# EAGLE design v2_rev0 (EAGLE 5.11)
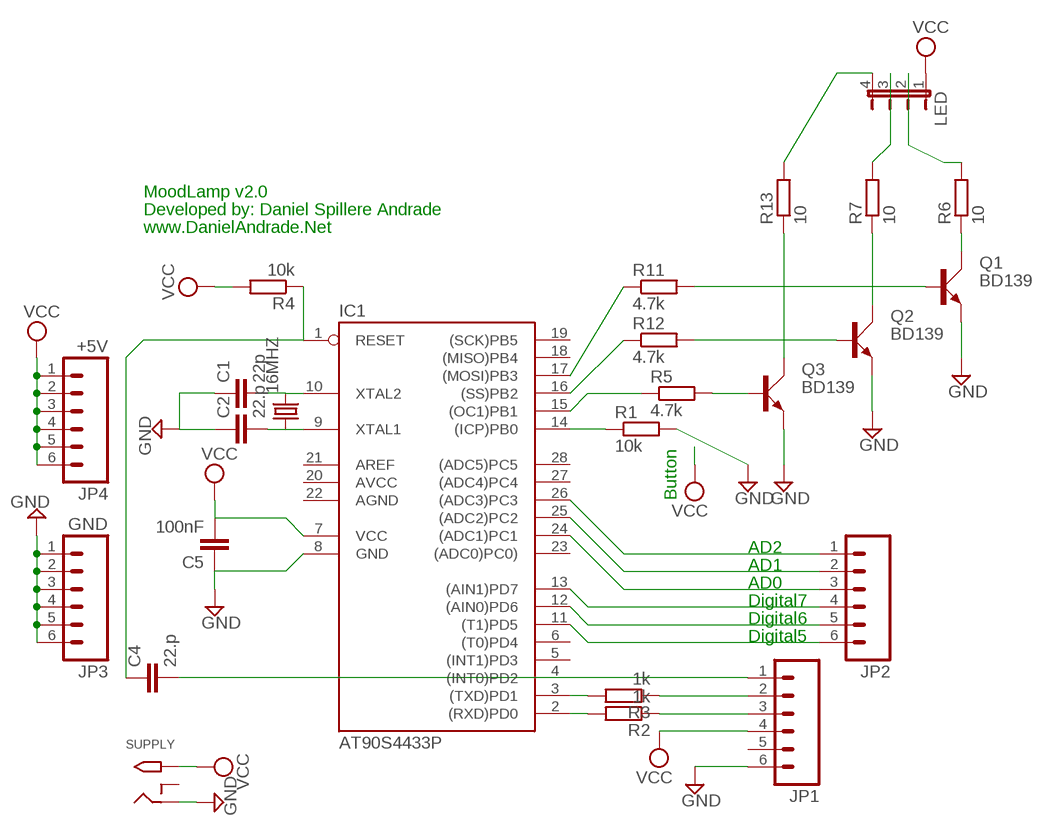
[diagram p0: schematic, sheet 1]

## Parts
16MHZ  CRYSTALHC49S  [HC49/S]
C1  22p  C5/2.5  [C5B2.5]
C2  22.p  C5/2.5  [C5B2.5]
C4  22.p  C5/2.5  [C5B2.5]
C5  100nF  C5/2.5  [C5B2.5]
IC1  AT90S4433P  [DIL28-3]
JP1  M06SIP  [1X06]
JP2  M06SIP  [1X06]
JP3  GND  M06SIP  [1X06]
JP4  +5V  M06SIP  [1X06]
LED  JP4E  [JP4]
Q1  BD139  [TO126AV]
Q2  BD139  [TO126AV]
Q3  BD139  [TO126AV]
R1  10k  R-EU_0309/V  [0309V]
R2  1k  R-EU_0207/10  [0207/10]
R3  1k  R-EU_0207/10  [0207/10]
R4  10k  R-EU_0207/10  [0207/10]
R5  4.7k  R-EU_0207/10  [0207/10]
R6  10  R-EU_0207/10  [0207/10]
R7  10  R-EU_0207/10  [0207/10]
R11  4.7k  R-EU_0207/10  [0207/10]
R12  4.7k  R-EU_0207/10  [0207/10]
R13  10  R-EU_0207/10  [0207/10]
SUPPLY  2.1MMJACKTHM  [PJ-102A]

## Nets
N$1: C4.1 IC1.1(RESET) R4.1
N$2: 16MHZ.2 C1.2 IC1.10(XTAL2)
N$3: 16MHZ.1 C2.2 IC1.9(XTAL1)
N$4: IC1.15((OC1)PB1) R5.1
N$5: IC1.16((SS)PB2) R12.1
N$6: IC1.17((MOSI)PB3) R11.1
N$7: Q3.B R5.2
N$8: Q2.B R12.2
N$9: Q1.B R11.2
N$10: Q2.C R7.1
N$11: Q3.C R13.1
N$12: Q1.C R6.1
N$14: IC1.2((RXD)PD0) R2.2
N$15: IC1.3((TXD)PD1) R3.2
N$16: JP1.3 R2.1
N$17: JP1.2 R3.1
N$18: C4.2 JP1.1
N$19: IC1.11((T1)PD5) JP2.6
N$20: IC1.12((AIN0)PD6) JP2.5
N$21: IC1.13((AIN1)PD7) JP2.4
N$22: IC1.24((ADC1)PC1) JP2.3
N$23: IC1.25((ADC2)PC2) JP2.2
N$24: IC1.26((ADC3)PC3) JP2.1
N$25: LED.2 R6.2
N$26: IC1.14((ICP)PB0) R1.1
N$29: C1.1 C2.1 C5.1 IC1.8(GND) JP1.6 JP3.1 JP3.2 JP3.3 JP3.4 JP3.5 JP3.6 Q1.E Q2.E Q3.E R1.2 SUPPLY.RING ; supply symbol labelled GND
N$30: LED.3 R7.2
N$31: LED.4 R13.2
VCC: C5.2 IC1.7(VCC) JP1.4 JP4.1 JP4.2 JP4.3 JP4.4 JP4.5 JP4.6 LED.1 R4.2 SUPPLY.TIP
Unconnected: IC1.4((INT0)PD2) IC1.5((INT1)PD3) IC1.6((T0)PD4) IC1.18((MISO)PB4) IC1.19((SCK)PB5) IC1.21(AREF) IC1.23((ADC0)PC0)) IC1.27((ADC4)PC4) IC1.28((ADC5)PC5) JP1.5 SUPPLY.RING_SW

## Notes on the sheet
- MoodLamp v2.0
- Developed by: Daniel Spillere Andrade
- www.DanielAndrade.Net
- Button
- AD2
- AD1
- AD0
- Digital7
- Digital6
- Digital5

## Power pins joined to a net without a drawn wire
AGND: IC1.22(AGND)
AVCC: IC1.20(AVCC)

## Library data of the parts
16MHZ = crystal:CRYSTAL: CRYSTAL; OC_FARNELL: 1667008; OC_NEWARK: unknown
C1 C2 C4 C5 = capacitor-wima:C: CAPACITOR naming: grid - package width
IC1 = atmel:AT90S4433: MICROCONTROLLER 4 Kbytes FLASH 128 bytes SRAM 256 bytes EEPROM UART 6-channel 10 bit ADC; OC_FARNELL: unknown; OC_NEWARK: unknown
JP1-JP4 = SparkFun:M06: Header 6 Standard 6-pin 0.1" header. Use with straight break away headers (SKU : PRT-00116), right angle break away headers (PRT-00553), swiss pins (PRT-00743), machine pins (PRT-00117), and female headers (PRT-00115). Molex polarized connector foot print use with SKU : PRT-08094 with associated crimp pins and housings. NOTES ON THE VARIANTS LOCK and LOCK_LONGPADS... This footprint was designed to help hold the alignment of a through-hole component (i.e. 6-pin header) while soldering it into place. You may notice that each hole has been shifted either up or down by 0.005 of an inch from it's more standard position (which is a perfectly straight line). This slight alteration caused the pins (the squares in the middle) to touch the edges of the holes. Because they are alternating, it causes a "brace" to hold the component in place. 0.005 has proven to be the perfect amount of "off-center" position when using our standard breakaway headers. Although looks a little odd when you look at the bare footprint, once you have a header in there, the alteration is very hard to notice. Also, if you push a header all the way into place, it is covered up entirely on the bottom side. This idea of altering the position of holes to aid alignment will be further integrated into the Sparkfun Library for other footprints. It can help hold any component with 3 or more connection pins.
LED = jumper:JP4E: JUMPER
Q1-Q3 = transistor-power:BD139: NPN TRANSISTOR
R1 = rcl:R-EU_: RESISTOR, European symbol
R2-R7 R11-R13 = resistor:R-EU_: RESISTOR, European symbol
SUPPLY = adafruit:2.1MMJACK: 2.1mm x 5.5mm THM DC jack with internal switch. Digikey part #PJ-102A, 4UCON part #05537 2.1mm x 5.5mm SMT DC jack with internal switch. Digikey part #PJ-002A-SMT, 4UCON part #03267 By microbuilder.eu & adafruit.com

## Board
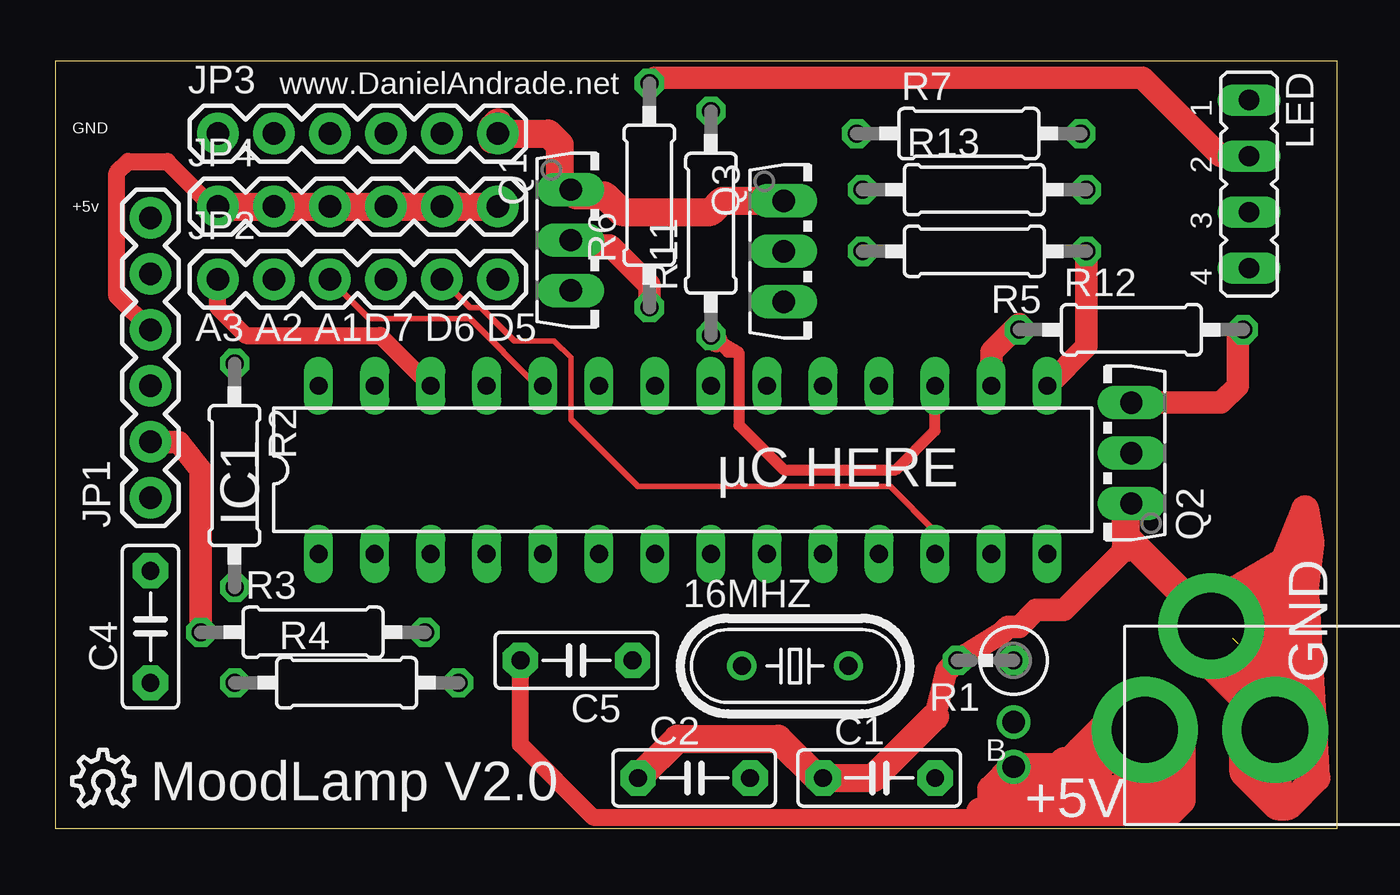
[diagram p1: board, top side]
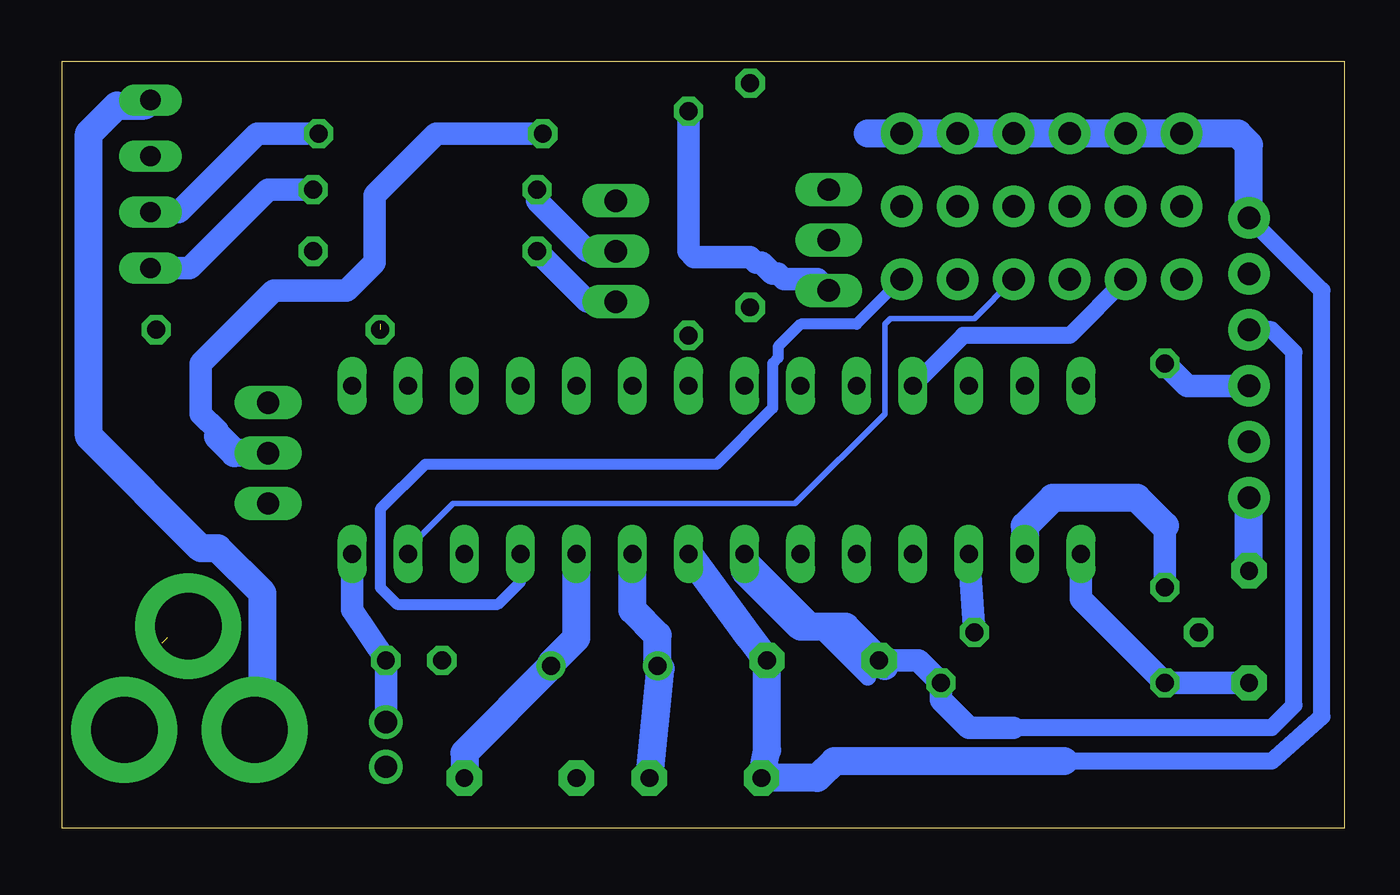
[diagram p2: board, bottom side, seen from below]

Size 58.09 x 34.79 mm. Coordinates in mm from the lower left corner, seen from the top.
Outline: 0,0 58.09,0 58.09,34.79 0,34.79 0,0
Copper layers (1*16): Top 0.035mm / dielectric 1.5mm / Bottom 0.035mm
Design rules "default": minimum track width 10mil, minimum drill 24mil, track to track 8mil, track to pad 8mil, pad to pad 8mil, via to via 8mil, smd to smd 8mil, copper to edge 40mil, drill to drill 8mil, minimum pad ring 10mil, minimum via ring 8mil, stop-mask expansion 4mil, vias tented up to drill 0mil, thermal gap 10mil

### Footprints (pad centres in the part's own frame; a part is rotated, then mirrored left to right if it is on the bottom)
HC49/S = drill 0.813 round: 1 -2.413,0; 2 2.413,0
C5B2.5 = drill 0.813 pad 1.6 octagon: 1 -2.54,0; 2 2.54,0
DIL28-3 = drill 0.813 long: 1 -16.51,-3.81; 2 -13.97,-3.81; 3 -11.43,-3.81; 4 -8.89,-3.81; 5 -6.35,-3.81; 6 -3.81,-3.81; 7 -1.27,-3.81; 8 1.27,-3.81; 9 3.81,-3.81; 10 6.35,-3.81; 11 8.89,-3.81; 12 11.43,-3.81; 13 13.97,-3.81; 14 16.51,-3.81; 15 16.51,3.81; 16 13.97,3.81; 17 11.43,3.81; 18 8.89,3.81; 19 6.35,3.81; 20 3.81,3.81; 21 1.27,3.81; 22 -1.27,3.81; 23 -3.81,3.81; 24 -6.35,3.81; 25 -8.89,3.81; 26 -11.43,3.81; 27 -13.97,3.81; 28 -16.51,3.81
1X06 = drill 1.016 pad 1.88 round: 1 0,0; 2 2.54,0; 3 5.08,0; 4 7.62,0; 5 10.16,0; 6 12.7,0
JP4 = drill 0.914 long: 1 -3.81,0; 2 -1.27,0; 3 1.27,0; 4 3.81,0
TO126AV = drill 1.016 long: B 2.286,-1.27; C 0,-1.27; E -2.286,-1.27
0309V = drill 0.813 octagon: 1 -1.27,0; 2 1.27,0
0207/10 = drill 0.813 octagon: 1 -5.08,0; 2 5.08,0
PJ-102A = drill 3 pad 4.8 round: RING 0.1,-3.39; RING_SW -4.6,-6.29; TIP 0.1,-9.29

### Placement (x,y rotation side)
16MHZ  33.53,7.37 0 top
C1  37.34,2.29 0 top
C2  28.96,2.29 0 top
C4  4.32,9.14 90 top
C5  23.62,7.62 180 top
IC1  28.45,16.26 0 top
JP1  4.32,14.99 90 top
JP2  7.37,24.89 0 top
JP3  7.37,31.5 0 top
JP4  7.37,28.19 0 top
LED  54.1,29.21 270 top
Q1  24.64,26.67 270 top
Q2  47.5,17.02 90 top
Q3  34.29,26.16 270 top
R1  42.16,7.62 180 top
R2  8.13,16 270 top
R3  11.68,8.89 0 top
R4  13.21,6.6 0 top
R5  41.66,26.16 180 top
R6  26.92,28.7 90 top
R7  41.4,31.5 0 top
R11  29.72,27.43 90 top
R12  48.77,22.61 0 top
R13  41.66,28.96 0 top
SUPPLY  58.67,4.57 270 top
U$1  [OSHW_8X100_NOTEXT]  0.76,1.02 0 top
U$3  [OSHW_10X500_NOTEXT]  21.59,-26.16 0 top  (outside the outline)

### Tracks (layer width: path | path; a pad name or v marks a point on that pad's centre or on a via)
N$1
  Bottom 1.016: C4.1 R4.1 11.94,10.41 IC1.1
N$2
  Bottom 1.27: IC1.10 34.8,8.64 35.94,7.49 16MHZ.2 39.88,3.43 C1.2
N$3
  Bottom 1.27: IC1.9 32.26,9.91 31.12,8.76 16MHZ.1 30.99,7.24 C2.2
N$4
  Top 1.016: IC1.15 46.74,21.84 R5.1
N$5  (1 unrouted)
  Top 1.016: 43.69,22.86 42.42,21.59 IC1.16
N$6
  Top 0.508: 30.99,21.59 R11.1 | IC1.17 39.88,18.03 38.1,16.26 33.02,16.26 30.99,18.29 30.99,21.59 | 29.97,22.1 30.48,21.59 30.99,21.59
  Top 1.016: R11.1 29.97,22.1
N$7
  Bottom 1.016: Q3.B 34.29,23.88 R5.2
N$8
  Top 1.016: R12.2 53.59,22.35 53.59,20.07 52.83,19.3 Q2.B
N$9
  Bottom 1.016: Q1.B 23.88,24.89 25.4,24.89 25.65,25.15 25.91,25.15 26.42,25.65 26.67,25.65 26.92,25.91 29.46,25.91 29.72,26.16 R11.2
N$10
  Bottom 1.016: R7.1 41.15,31.5 43.94,28.7 43.94,25.65 45.21,24.38 48.51,24.38 51.82,21.08 51.82,18.8 51.05,18.03 51.05,17.78
  Bottom 1.27: Q2.C 50.29,17.02 51.05,17.78
N$11
  Bottom 1.016: Q3.C 34.29,26.16 36.58,28.45 R13.1
N$12
  Top 1.016: Q1.C 23.62,26.67 23.88,26.42 25.15,26.42 26.92,24.64 R6.1
N$14
  Bottom 1.016: R2.2 8.13,13.72
  Bottom 1.27: 8.13,13.72 9.4,14.99 13.21,14.99 14.48,13.72 IC1.2
N$15
  Bottom 1.016: R3.2 IC1.3
N$16
  Bottom 1.016: R2.1 7.11,20.07 JP1.3
N$17
  Top 1.016: JP1.2 5.59,17.53 6.6,16.26 R3.1
N$18
  Bottom 1.27: C4.2 JP1.1
N$19
  Bottom 0.508: JP2.6 22.1,22.86 24.64,22.86 25.65,21.84 25.65,21.34 25.91,21.08 25.91,19.05 28.45,16.51 41.66,16.51 43.69,14.48 43.69,10.92 42.93,10.16 38.35,10.16 37.34,11.18 IC1.11
N$20
  Top 0.254: JP2.5 18.8,23.62 19.3,23.62 20.83,22.1 22.61,22.1 23.37,21.34 23.37,18.54 26.42,15.49 37.85,15.49 39.88,13.46 IC1.12
N$21
  Bottom 0.254: JP2.4 16.76,23.11 20.57,23.11 20.83,22.86 20.83,18.8 24.89,14.73 40.39,14.73 42.42,12.7 IC1.13
N$22
  Top 0.254: JP2.3 14.22,23.11 18.8,23.11 21.84,20.07 IC1.24
N$23
  Bottom 0.762: JP2.2 12.45,22.35 17.27,22.35 IC1.25
N$24
  Top 0.762: IC1.26 14.73,22.35 8.64,22.35 7.37,23.62 JP2.1
N$25
  Top 1.016: R6.2 27.18,34.04 49.28,34.04 52.83,30.48 LED.2
N$26  (via drill 1.02)
  Bottom 1.016: IC1.14 44.96,9.91 R1.1 v43.43,4.83
N$27  (via drill 1.02)
  Top 1.27: 45.72,3.05 45.47,2.79 v43.43,2.79 42.42,1.78 42.42,1.02 43.18,1.78 43.94,1.78 42.93,0.76 41.91,0.76
N$29
  Top 0.254: 19.81,31.24 19.56,31.5 JP3.6
  Top 1.016: 39.88,5.08 40.39,7.11 R1.2 42.93,8.89 43.18,9.14 43.69,9.14 44.45,9.91 45.72,9.91 48.51,12.7
  Top 1.27: Q2.E 48.51,14.48 48.51,13.21 | 48.51,13.21 48.51,12.7 | 39.88,5.08 37.08,2.29 C1.1 34.54,2.29 32.77,4.06 28.19,4.06 C2.1 | SUPPLY.RING 52.07,7.69 52.07,9.65 48.51,13.21 | 20.07,32 19.81,31.75 19.81,31.24 20.07,31.24 | Q3.E 30.23,28.45 29.72,27.94 25.65,27.94 24.89,28.7 23.62,28.7 Q1.E 22.86,29.46 22.86,30.99 22.35,31.5 JP3.6
  Bottom 0.762: JP1.6 1.02,24.38 1.02,5.08 3.3,3.05 12.7,3.05
  Bottom 1.27: 12.7,3.05 23.11,3.05 23.88,2.29 C2.1 26.16,3.56 C5.1 26.92,8.64 IC1.8 | JP1.6 4.32,30.99 4.83,31.5 JP3.1 JP3.2 JP3.3 JP3.4 JP3.5 JP3.6 21.59,31.5
N$30
  Bottom 1.016: R7.2 49.28,31.5 52.83,27.94 LED.3
N$31
  Bottom 1.016: R13.2 48.77,28.96 52.32,25.4 LED.4
N$33  (1 unrouted)
  Top 1.27: 54.1,4.57 54.36,4.32 54.36,3.56 54.86,3.05 56.13,3.05 56.64,3.56 56.64,4.32 55.88,5.08 55.63,5.08 55.12,4.57 55.12,4.06 56.13,4.06 56.9,4.83 55.37,11.94 52.32,10.16 52.07,10.16 51.31,9.4 51.31,8.64 52.07,7.87 52.58,7.87 53.34,8.64 53.34,9.65 55.88,12.19 56.64,10.92 | 56.64,10.92 55.88,6.1 54.61,7.37 54.61,9.65 53.85,8.89 53.85,7.37 55.12,6.1 | 55.12,6.1 55.63,5.59 | 55.12,6.1 55.12,10.67 56.64,14.48 56.9,12.95 56.64,10.92 | 56.64,10.92 57.15,2.29 55.88,1.02 55.37,1.02 53.85,2.54 53.85,4.57 55.37,3.05 55.37,2.03 | 53.59,8.38 53.59,6.86
N$35
  Top 1.27: 49.02,6.1 43.69,0.76 50.55,0.76 51.05,1.27 51.05,4.57 50.29,5.33 49.28,5.33 48.26,4.32 48.01,4.32 48.77,3.56 49.02,3.56 49.78,4.32 50.29,4.32 50.04,4.06 50.04,2.03 49.78,1.78 45.47,1.78 47.75,4.06 48.77,4.06 48.51,3.81 48.51,2.79 49.02,2.79
VCC
  Top 0.254: JP4.2 10.67,27.69 10.67,28.19 | 13.21,28.19 13.21,27.69 JP4.3 | JP4.4 15.75,27.69 15.75,28.19 | JP4.5 18.29,27.69 18.29,28.19
  Top 0.762: JP1.4 2.79,24.13 2.79,29.72 3.3,30.23 5.08,30.23 7.11,28.19 | SUPPLY.TIP 45.42,0.51 24.38,0.51 21.08,3.81 C5.2
  Top 1.27: JP4.6 18.29,28.19 JP4.5 15.75,28.19 JP4.4 13.21,28.19 JP4.3 10.67,28.19 JP4.2 JP4.1 7.11,28.19
  Bottom 0.762: IC1.7 21.59,6.86 | 14.99,4.57 3.3,4.57 2.29,5.59 2.29,21.59 3.3,22.61 JP1.4
  Bottom 1.016: C5.2 19.3,7.62 R4.2 18.29,5.84 17.02,4.57 14.99,4.57
  Bottom 1.27: IC1.7 27.18,11.68 24.64,9.14 22.61,9.14 C5.2 20.83,7.37 | LED.1 54.36,32.77 55.63,32.77 56.9,31.5 56.9,17.78 51.82,12.7 51.05,12.7 49.02,10.67 49.02,5.33 49.38,4.97 SUPPLY.TIP

### Text on the board
tPlace: www.DanielAndrade.net | GND | +5v | A3 A2 A1 | D7 D6 D5 | GND | B | MoodLamp V2.0 | +5V | Released under Creative Commons Attribution-Sharealike (CC BY-SA 3.0) license | Made by Daniel Spillere Andrade | www.DanielAndrade.net | OPEN HARDWARE
tNames: µC HERE